# Altium project pca10184.PrjPcb (part 5 of 5)

## Sheet pca10184_level_shifters.SchDoc: =ProductName + ' - Level Shifters'
size A3; Organization: Nordic Semiconductor; DocumentNumber: 4; Revision: 0.7.0; SheetNumber: 4; SheetTotal: 9; Author: GETR; CompanyName: Nordic Semiconductor; DrawnBy: GETR; DocumentSize: A4; ProjectName: pca10184.PrjPcb
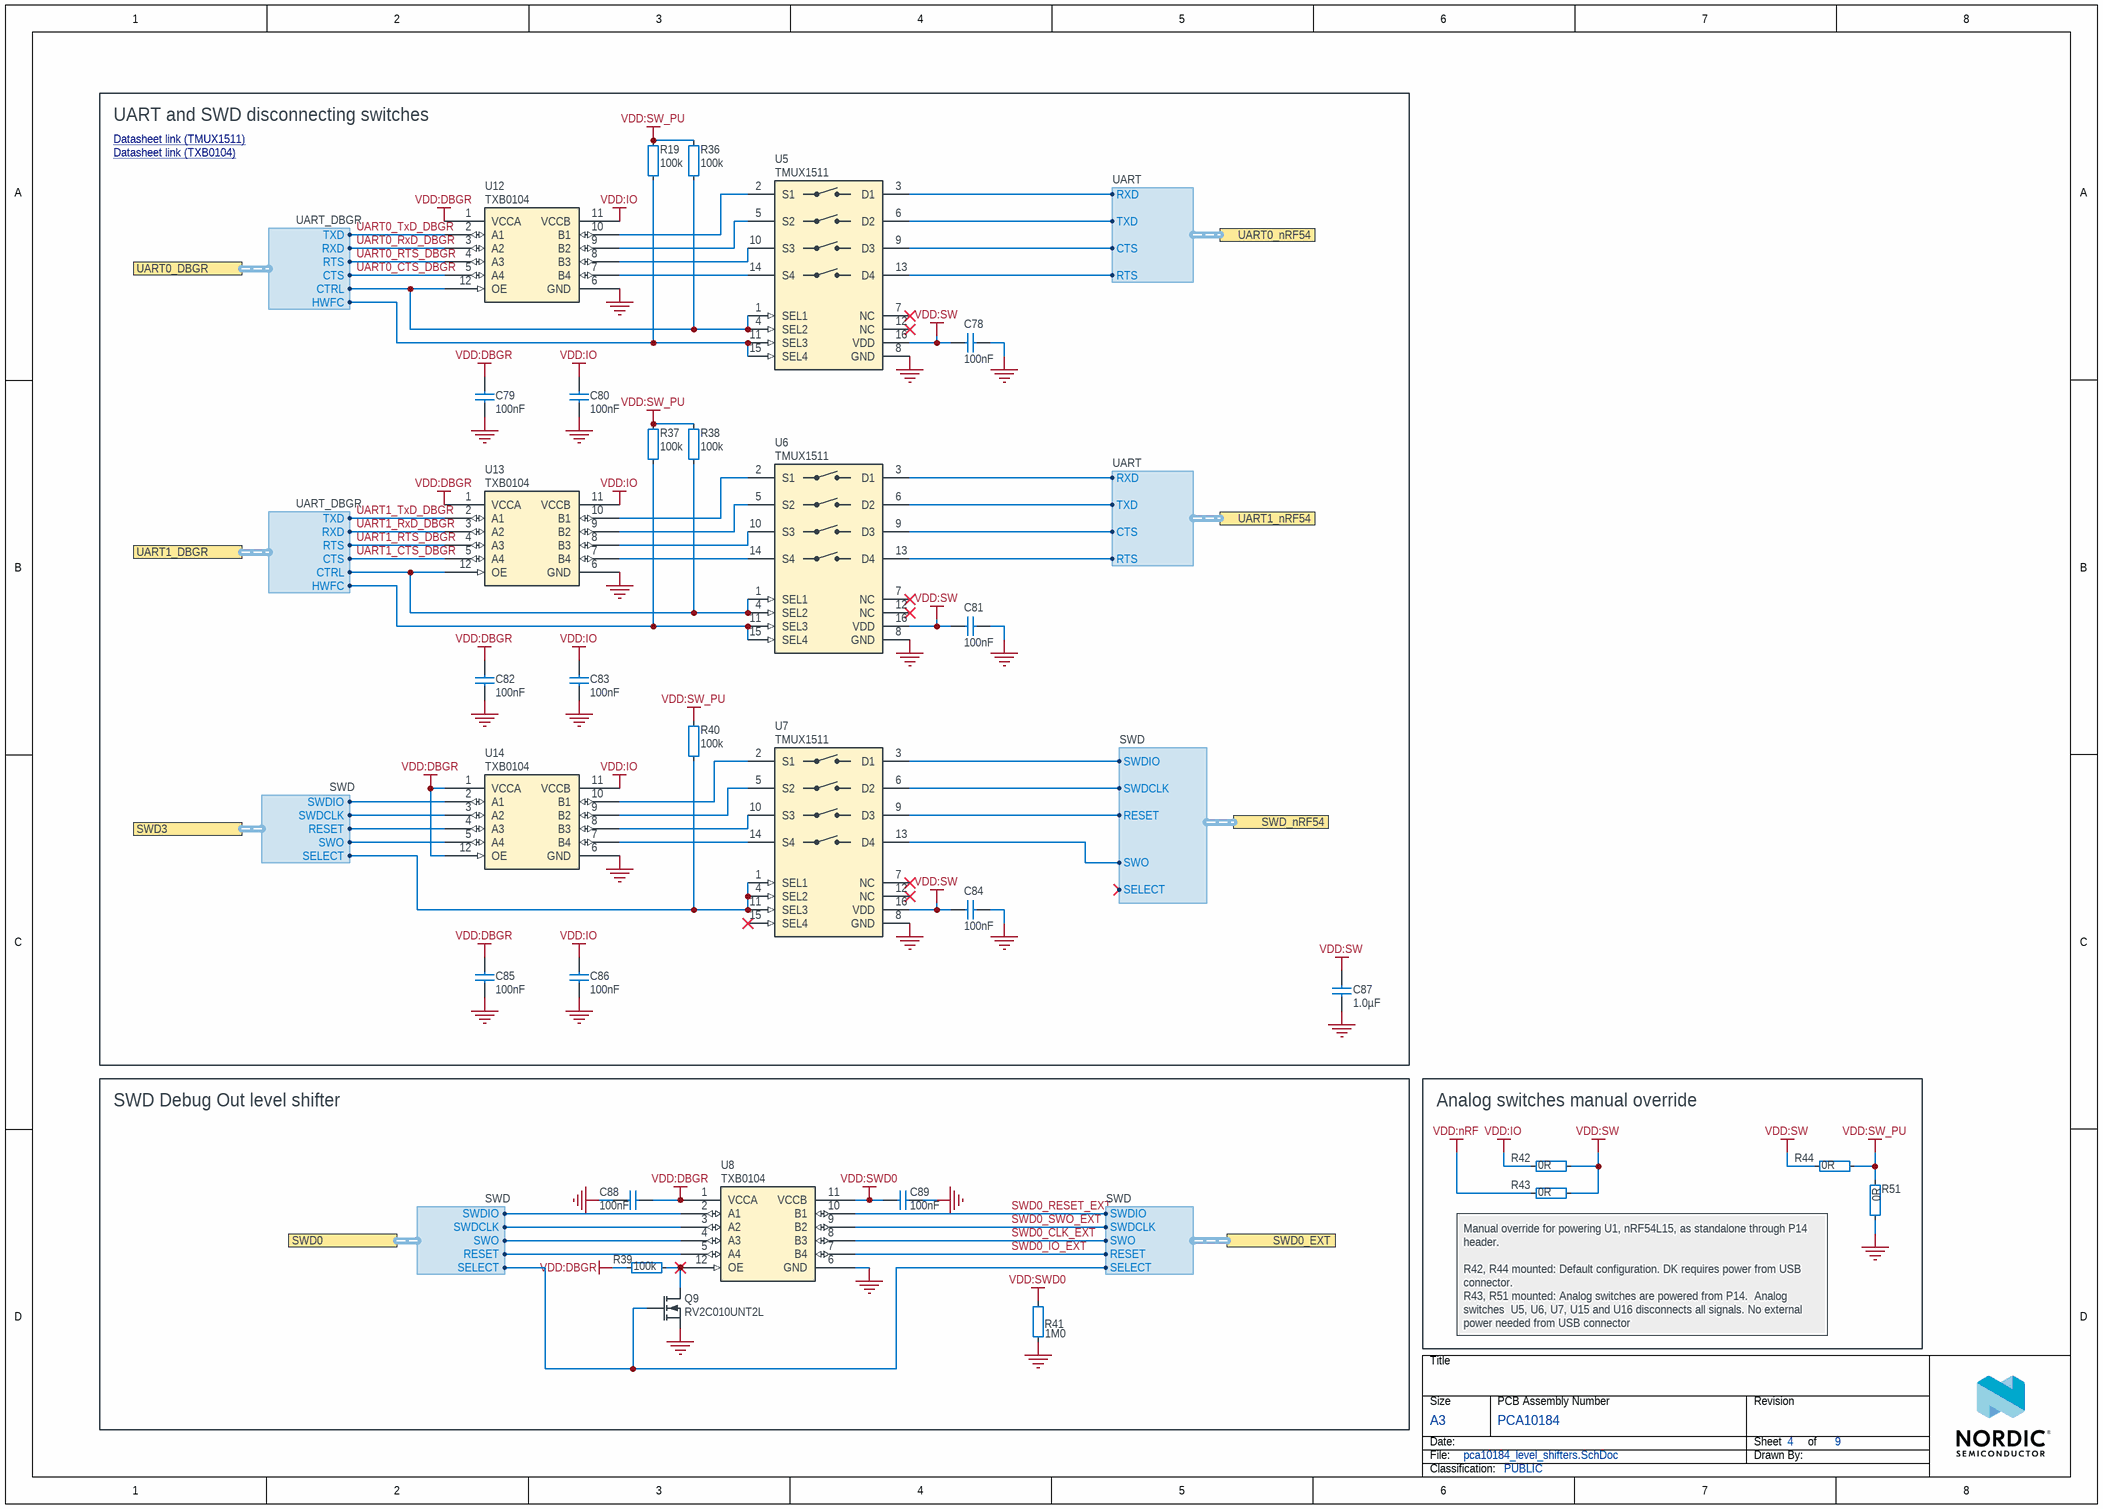
[diagram p7: pca10184_level_shifters.SchDoc]

### Parts
C78  100nF  [CAPC0603X03L_C]
C79  100nF  [CAPC0603X03L_C]
C80  100nF  [CAPC0603X03L_C]
C81  100nF  [CAPC0603X03L_C]
C82  100nF  [CAPC0603X03L_C]
C83  100nF  [CAPC0603X03L_C]
C84  100nF  [CAPC0603X03L_C]
C85  100nF  [CAPC0603X03L_C]
C86  100nF  [CAPC0603X03L_C]
C87  1.0µF  [CAPC1005X04L]
C88  100nF  [CAPC0603X03L_C]
C89  100nF  [CAPC0603X03L_C]
Q9  RV2C010UNT2L  [DFN65P100X40-3L]
R19  100k  [RESC0603X03L_C]
R36  100k  [RESC0603X03L_C]
R37  100k  [RESC0603X03L_C]
R38  100k  [RESC0603X03L_C]
R39  100k  [RESC0603X03L_C]
R40  100k  [RESC0603X03L_C]
R41  1M0  [RESC0603X03L_C]
R42  0R  [RESC1005X04L]
R43  0R  [RESC1005X04L]
R44  0R  [RESC1005X04L]
R51  0R  [RESC1005X04L]
U5  TMUX1511  [XQFN40P180X260X50-16N]
U6  TMUX1511  [XQFN40P180X260X50-16N]
U7  TMUX1511  [XQFN40P180X260X50-16N]
U8  TXB0104  [QFN12P40_170X200X55L50X20]
U12  TXB0104  [QFN12P40_170X200X55L50X20]
U13  TXB0104  [QFN12P40_170X200X55L50X20]
U14  TXB0104  [QFN12P40_170X200X55L50X20]

### Blocks framed on the sheet
UART and SWD disconnecting switches: C78-C87 R19 R36-R38 R40 U5-U7 U12-U14
SWD Debug Out level shifter: C88 C89 Q9 R39 R41 U8
Analog switches manual override: R42-R44 R51

### Ports
SWD0 (harness SWD), SWD0_EXT (harness SWD), SWD3 (harness SWD), SWD_nRF54 (harness SWD), UART0_DBGR (harness UART_DBGR), UART0_nRF54 (harness UART), UART1_DBGR (harness UART_DBGR), UART1_nRF54 (harness UART)

### Harnesses
SWD: SWDIO, SWDCLK, SWO, RESET, SELECT
UART_DBGR: RTS, CTS, RXD, TXD, HWFC, CTRL
UART: RTS, CTS, RXD, TXD

### Nets
GND: C78.2 C79.2 C80.2 C81.2 C82.2 C83.2 C84.2 C85.2 C86.2 C87.1 C88.1 C89.2 Q9.2(S) R41.1 R51.2 U5.8(GND) U6.8(GND) U7.8(GND) U8.6(GND) U12.6(GND) U13.6(GND) U14.6(GND)
VDD:DBGR: C79.1 C82.1 C85.1 C88.2 R39.2 U8.1(VCCA) U12.1(VCCA) U13.1(VCCA) U14.1(VCCA) U14.12(OE)
VDD:IO: C80.1 C83.1 C86.1 R42.1 U12.11(VCCB) U13.11(VCCB) U14.11(VCCB)
VDD:nRF: R43.1
VDD:SW: C78.1 C81.1 C84.1 C87.2 R42.2 R43.2 R44.2 U5.16(VDD) U6.16(VDD) U7.16(VDD)
VDD:SW_PU: R19.1 R36.1 R37.1 R38.1 R40.1 R44.1 R51.1
VDD:SWD0: C89.1 R41.2 U8.11(VCCB)
nRF54_RESET: U7.9(D3) ; port SWD_nRF54.RESET
P0.06: U5.6(D2) ; port UART0_nRF54.TXD
P0.07: U5.3(D1) ; port UART0_nRF54.RXD
P0.08: U5.13(D4) ; port UART0_nRF54.RTS
P0.09: U5.9(D3) ; port UART0_nRF54.CTS
P1.16: U6.6(D2) ; port UART1_nRF54.TXD
P1.17: U6.3(D1) ; port UART1_nRF54.RXD
P1.18: U6.13(D4) ; port UART1_nRF54.RTS
P1.19: U6.9(D3) ; port UART1_nRF54.CTS
P2.07: U7.13(D4) ; port SWD_nRF54.SWO
SWD0_CLK_EXT: U8.8(B3) ; port SWD0_EXT.SWO
SWD0_IO_EXT: U8.7(B4) ; port SWD0_EXT.RESET
SWD0_RESET_EXT: U8.10(B1) ; port SWD0_EXT.SWDIO
SWD0_SEL: Q9.1(G) ; port SWD0.SELECT, port SWD0_EXT.SELECT
SWD0_SWO_EXT: U8.9(B2) ; port SWD0_EXT.SWDCLK
SWD3_CTRL: R40.2 U7.1(SEL1) U7.4(SEL2) U7.11(SEL3) ; port SWD3.SELECT
SWDCLK: U7.6(D2) ; port SWD_nRF54.SWDCLK
SWDIO: U7.3(D1) ; port SWD_nRF54.SWDIO
UART0_CTRL: R36.2 U5.1(SEL1) U5.4(SEL2) U12.12(OE) ; port UART0_DBGR.CTRL
UART0_CTS_DBGR: U12.5(A4) ; port UART0_DBGR.CTS
UART0_HWFC: R19.2 U5.11(SEL3) U5.15(SEL4) ; port UART0_DBGR.HWFC
UART0_RTS_DBGR: U12.4(A3) ; port UART0_DBGR.RTS
UART0_RxD_DBGR: U12.3(A2) ; port UART0_DBGR.RXD
UART0_TxD_DBGR: U12.2(A1) ; port UART0_DBGR.TXD
UART1_CTRL: R38.2 U6.1(SEL1) U6.4(SEL2) U13.12(OE) ; port UART1_DBGR.CTRL
UART1_CTS_DBGR: U13.5(A4) ; port UART1_DBGR.CTS
UART1_HWFC: R37.2 U6.11(SEL3) U6.15(SEL4) ; port UART1_DBGR.HWFC
UART1_RTS_DBGR: U13.4(A3) ; port UART1_DBGR.RTS
UART1_RxD_DBGR: U13.3(A2) ; port UART1_DBGR.RXD
UART1_TxD_DBGR: U13.2(A1) ; port UART1_DBGR.TXD
NetQ9_3: Q9.3(D) R39.1 U8.12(OE)
NetR6_2: U8.2(A1) ; port SWD0.SWDIO
NetR12_2: U8.3(A2) ; port SWD0.SWDCLK
NetR13_2: U8.4(A3) ; port SWD0.SWO
NetR47_2: U8.5(A4) ; port SWD0.RESET
NetR48_2: U14.2(A1) ; port SWD3.SWDIO
NetR49_2: U14.3(A2) ; port SWD3.SWDCLK
NetR50_2: U14.4(A3) ; port SWD3.RESET
NetR57_2: U14.5(A4) ; port SWD3.SWO
NetU5_2: U5.2(S1) U12.10(B1)
NetU5_5: U5.5(S2) U12.9(B2)
NetU5_10: U5.10(S3) U12.8(B3)
NetU5_14: U5.14(S4) U12.7(B4)
NetU6_2: U6.2(S1) U13.10(B1)
NetU6_5: U6.5(S2) U13.9(B2)
NetU6_10: U6.10(S3) U13.8(B3)
NetU6_14: U6.14(S4) U13.7(B4)
NetU7_2: U7.2(S1) U14.10(B1)
NetU7_5: U7.5(S2) U14.9(B2)
NetU7_10: U7.10(S3) U14.8(B3)
NetU7_14: U7.14(S4) U14.7(B4)

Not connected (* = marked no-connect by the designer): U5 7(NC)* 12(NC)*; U6 7(NC)* 12(NC)*; U7 7(NC)* 12(NC)* 15(SEL4)*

### Notes on the sheet
- Datasheet link (TMUX1511) <https://www.ti.com/lit/ds/symlink/tmux1511.pdf?ts=1730882090102&ref_url=https%253A%252F%252Fwww.mouser.dk%252F>
- Datasheet link (TXB0104) <https://www.ti.com/lit/ds/symlink/txb0104.pdf?src-supplier=IHS+Markit>
- (near R43) Manual override for powering U1, nRF54L15, as standalone through P14 header.
  R42, R44 mounted: Default configuration. DK requires power from USB connector.
  R43, R51 mounted: Analog switches are powered from P14.  Analog switches  U5, U6, U7, U15 and U16 disconnects all signals. No external power needed from USB connector
- Title
- Size
- Date:
- File:
- A3
- PCB Assembly Number
- Sheet
- Drawn By:
- Revision
- of
- Classification:

### Library data of the parts
C78-C86 C88 C89 = C0201-100n: Capacitor, X5R, ±10%; Manufacturer: N.A.; Part number IPS: 00000001248, 00000002505; Part number Norautron: 262071862; Part number NEMS: 100200078; Pad Count: 2; Note: 16V; Component Status: Active; Part Number: C0201-100n; Value: 100nF; Footprint Doc: 0201; Component Class: Capacitors; Author: rsk; PartId: 100200078; Manufacturer Part Number: N.A.; ComponentLink1URL: N.A.; ComponentLink1Description: Datasheet; ComponentLink2URL: N.A.; ComponentLink2Description: Supplier link; HelpURL: N.A.; LatestRevisionDate: 2017-11-09; Published: 2014-11-13; Supplier 1: N.A.; Supplier Part Number 1: N.A.; Supplier 2: N.A.; Supplier Part Number 2: N.A.; Artikkelnr Noca: N.A.
C87 = C0402-1µ0-6.3V-X5R-10%: Capacitor, X5R, ±10%, 6.3V; Manufacturer: N.A.; Part number Norautron: 26207137; Part number NEMS: 100200498; Pad Count: 2; Component Status: Active; Part Number: C0402-1µ0-6.3V-X5R-10%; Manufacturer Part Number: N.A.; LatestRevisionDate: 2022-01-27; Published: 2022-01-27; Value: 1.0µF; Note: 6.3V; Artikkelnr Noca: N.A.; Footprint Doc: 0402; ComponentLink1URL: N.A.; ComponentLink1Description: Datasheet; ComponentLink2URL: N.A.; ComponentLink2Description: Supplier link; HelpURL: N.A.; Supplier 1: N.A.; Supplier Part Number 1: N.A.; Supplier 2: N.A.; Supplier Part Number 2: N.A.; Part number IPS: N.A.; Component Class: Capacitors; PartId: 100200498; Author: rubr
Q9 = RV2C010UNT2L: as Q4-Q7 on sheet pca10184_misc; Part Number: RV2C010UNT2L; Manufacturer Part Number: RV2C010UNT2L; ComponentLink1URL: N.A.; ComponentLink1Description: Datasheet; ComponentLink2URL: N.A.; ComponentLink2Description: Supplier link; HelpURL: http://rohmfs.rohm.com/en/products/databook/datasheet/discrete/transistor/mosfet/rv2c010unt2l-e.pdf; Footprint Doc: DFN-3; LatestRevisionDate: 2024-09-18; Published: 2016-08-09; Value: RV2C010UNT2L; Supplier 1: Digi-Key; Supplier Part Number 1: RV2C010UNT2LCT-ND; Supplier 2: Mouser; Supplier Part Number 2: 755-RV2C010UNT2L; PartId: 101300132; Component Class: Semiconductors; Author: rsk
R19 R36-R40 = R0201-100k: Resistor, ±1%, 0.05W; Manufacturer: N.A.; Part number IPS: 00000001419; Part number Norautron: 26108487; Part number NEMS: 100100080; Note: Chip Res 1%; Pad Count: 2; Component Status: Active; Part Number: R0201-100k; Manufacturer Part Number: N.A.; ComponentLink1URL: N.A.; ComponentLink1Description: Datasheet; ComponentLink2URL: N.A.; ComponentLink2Description: Supplier link; HelpURL: N.A.; Footprint Doc: 0201; LatestRevisionDate: 2014-11-13; Published: 2014-11-13; Value: 100k; Artikkelnr Noca: N.A.; Supplier 1: N.A.; Supplier Part Number 1: N.A.; Supplier 2: N.A.; Supplier Part Number 2: N.A.; Component Class: Resistors; PartId: 100100080; Author: rsk
R41 = R0201-1M0: Resistor, ±1%, 0.05W; Manufacturer: N.A.; Part number IPS: 00000001418; Part number Norautron: 26107108; Part number NEMS: 100100093; Component Status: Active; Pad Count: 2; Note: Chip Res 1%; Part Number: R0201-1M0; PartId: 100100093; Component Class: Resistors; Author: rsk; Manufacturer Part Number: N.A.; ComponentLink1URL: N.A.; ComponentLink1Description: Datasheet; ComponentLink2URL: N.A.; ComponentLink2Description: Supplier link; HelpURL: N.A.; LatestRevisionDate: 2014-11-13; Published: 2014-11-13; Footprint Doc: 0201; Value: 1M0; Supplier 1: N.A.; Supplier Part Number 1: N.A.; Supplier 2: N.A.; Supplier Part Number 2: N.A.; Artikkelnr Noca: N.A.
R42-R44 R51 = R0402-0R: Resistor, ±5%, 0.063W; Manufacturer: N.A.; Part number IPS: 00000007128; Part number NEMS: 100100109; Component Status: Active; Pad Count: 2; Note: Chip Res 5%; Artikkelnr Noca: 27049000; Part Number: R0402-0R; PartId: 100100109; Component Class: Resistors; Author: rsk; Manufacturer Part Number: N.A.; ComponentLink1URL: N.A.; ComponentLink1Description: Datasheet; ComponentLink2URL: N.A.; ComponentLink2Description: Supplier link; HelpURL: N.A.; LatestRevisionDate: 2009-11-23; Published: 2009-05-08; Footprint Doc: 0402; Value: 0R; Supplier 1: Farnell; Supplier Part Number 1: 146-9661; Supplier 2: N.A.; Supplier Part Number 2: N.A.; Part number Norautron: N.A.
U5-U7 = TMUX1511: Low-Capacitance, 1:1 (SPST) 4-Channel, analog switch; Manufacturer: Texas Instruments; Manufacturer Part Number: TMUX1511RSVR; Part number NEMS: 101900847; Component Status: Active; Pad Count: 16; Note: N.A.; Part Number: TMUX1511; Component Class: Misc_ICs; Author: stl1; ComponentLink1URL: https://www.ti.com/lit/ds/symlink/tmux1511.pdf?ts=1730882090102&ref_url=https%253A%252F%252Fwww.mouser.dk%252F; ComponentLink1Description: Datasheet; ComponentLink2URL: N.A.; ComponentLink2Description: Supplier link; HelpURL: https://www.ti.com/lit/ds/symlink/tmux1511.pdf?ts=1730882090102&ref_url=https%253A%252F%252Fwww.mouser.dk%252F; LatestRevisionDate: 2024-12-05; Published: 2024-12-05; Footprint Doc: UFQFN-16; Value: TMUX1511; Supplier 1: Digi-Key; Supplier Part Number 1: 296-53443-2-ND; Supplier 2: Mouser; Supplier Part Number 2: 595-TMUX1511RSVR; Artikkelnr Noca: N.A.; Part number IPS: N.A.; Part number Norautron: N.A.; PartId: 101900847
U8 U12-U14 = TXB0104RUTR: 4-Bit Bidirectional Level-Shifter/Voltage Translator with Automatic Direction Sensing; Manufacturer: Texas Instruments; Part number NEMS: 101900856; Component Status: Active; Pad Count: 12; Note: Translator, Bidirectional; Artikkelnr Noca: N.A.; Part Number: TXB0104RUTR; Component Class: Misc_ICs; Author: stl1; Manufacturer Part Number: TXB0104RUTR; ComponentLink1URL: N.A.; ComponentLink1Description: Datasheet; ComponentLink2URL: N.A.; ComponentLink2Description: Supplier link; HelpURL: https://www.ti.com/lit/ds/symlink/txb0104.pdf?ts=1738584719537&ref_url=https%253A%252F%252Fwww.mouser.com%252F; LatestRevisionDate: 2025-02-04; Published: 2025-02-04; Footprint Doc: 12-UFQFN; Value: TXB0104; Supplier 1: Digi-Key; Supplier Part Number 1: 296-25888-2-ND; Supplier 2: Mouser; Supplier Part Number 2: 595-TXB0104RUTR; Part number IPS: N.A.; Part number Norautron: N.A.; PartId: 101900856

## Sheet pca10184_switches.SchDoc: =BoardTitle+' - QSPI Switching'
size A3; Organization: Nordic Semiconductor; DocumentNumber: 7; Revision: 0.7.0; SheetNumber: 7; SheetTotal: 9; Author: GETR; CompanyName: Nordic Semiconductor; DrawnBy: GETR; DocumentSize: A4; ProjectName: pca10184.PrjPcb
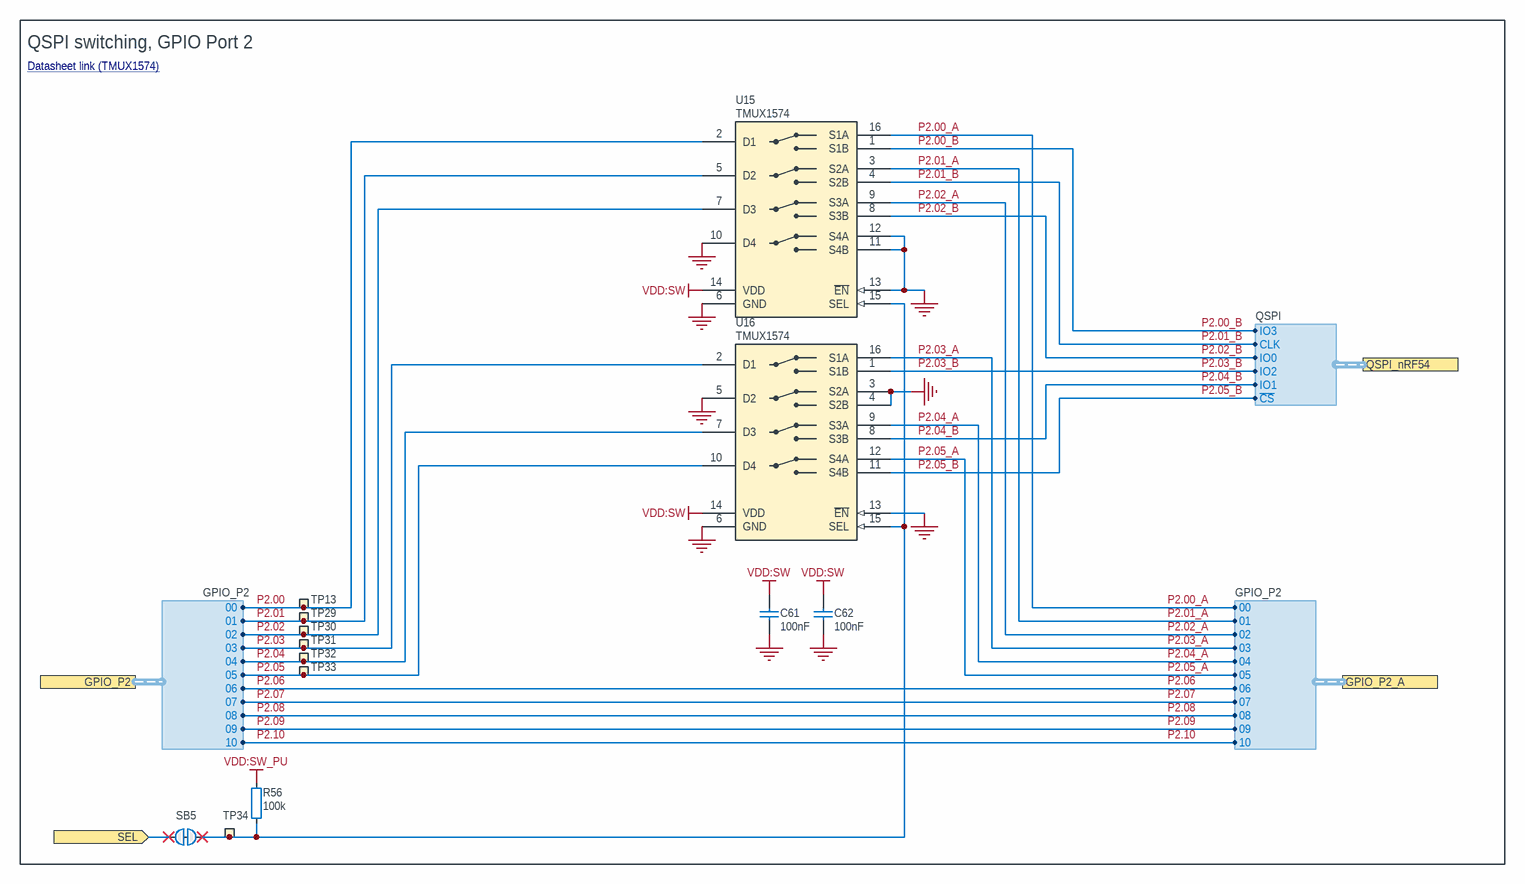
[diagram p8: pca10184_switches.SchDoc]

### Parts
C61  100nF  [CAPC0603X03L_C]
C62  100nF  [CAPC0603X03L_C]
R56  100k  [RESC0603X03L_C]
SB5  Solderbridge  [Solderbridge_Shorted]  (value not drawn)  (net tie, no BOM)
TP13  Ø0.7mm,SMD  [TP_SMD_D0.7mm]  (value not drawn)  (no BOM)
TP29  Ø0.7mm,SMD  [TP_SMD_D0.7mm]  (value not drawn)  (no BOM)
TP30  Ø0.7mm,SMD  [TP_SMD_D0.7mm]  (value not drawn)  (no BOM)
TP31  Ø0.7mm,SMD  [TP_SMD_D0.7mm]  (value not drawn)  (no BOM)
TP32  Ø0.7mm,SMD  [TP_SMD_D0.7mm]  (value not drawn)  (no BOM)
TP33  Ø0.7mm,SMD  [TP_SMD_D0.7mm]  (value not drawn)  (no BOM)
TP34  Ø0.7mm,SMD  [TP_SMD_D0.7mm]  (value not drawn)  (no BOM)
U15  TMUX1574  [XQFN40P180X260X50-16N]
U16  TMUX1574  [XQFN40P180X260X50-16N]

### Ports
GPIO_P2 (harness GPIO_P2), GPIO_P2_A (harness GPIO_P2), QSPI_nRF54 (harness QSPI), SEL (in)

### Harnesses
GPIO_P2: 00, 01, 02, 03, 04, 05, 06, 07, 08, 09, 10
QSPI: ~{CS}, IO0, CLK, IO1, IO2, IO3

### Nets
GND: C61.2 C62.2 U15.6(GND) U15.10(D4) U15.11(S4B) U15.12(S4A) U15.13(~{EN}) U16.3(S2A) U16.4(S2B) U16.5(D2) U16.6(GND) U16.13(~{EN})
VDD:SW: C61.1 C62.1 U15.14(VDD) U16.14(VDD)
VDD:SW_PU: R56.2
P2.00: TP13.1 U15.2(D1) ; port GPIO_P2.00
P2.00_A: U15.16(S1A) ; port GPIO_P2_A.00
P2.00_B: U15.1(S1B) ; port QSPI_nRF54.IO3
P2.01: TP29.1 U15.5(D2) ; port GPIO_P2.01
P2.01_A: U15.3(S2A) ; port GPIO_P2_A.01
P2.01_B: U15.4(S2B) ; port QSPI_nRF54.CLK
P2.02: TP30.1 U15.7(D3) ; port GPIO_P2.02
P2.02_A: U15.9(S3A) ; port GPIO_P2_A.02
P2.02_B: U15.8(S3B) ; port QSPI_nRF54.IO0
P2.03: TP31.1 U16.2(D1) ; port GPIO_P2.03
P2.03_A: U16.16(S1A) ; port GPIO_P2_A.03
P2.03_B: U16.1(S1B) ; port QSPI_nRF54.IO2
P2.04: TP32.1 U16.7(D3) ; port GPIO_P2.04
P2.04_A: U16.9(S3A) ; port GPIO_P2_A.04
P2.04_B: U16.8(S3B) ; port QSPI_nRF54.IO1
P2.05: TP33.1 U16.10(D4) ; port GPIO_P2.05
P2.05_A: U16.12(S4A) ; port GPIO_P2_A.05
P2.05_B: U16.11(S4B) ; port QSPI_nRF54.~{CS}
P2.06: port GPIO_P2.06, port GPIO_P2_A.06
P2.07: port GPIO_P2.07, port GPIO_P2_A.07
P2.08: port GPIO_P2.08, port GPIO_P2_A.08
P2.09: port GPIO_P2.09, port GPIO_P2_A.09
P2.10: port GPIO_P2.10, port GPIO_P2_A.10
QSPI_CTRL: SB5.1 ; port SEL
NetR56_1: R56.1 SB5.2 TP34.1 U15.15(SEL) U16.15(SEL)

### Notes on the sheet
- QSPI switching, GPIO Port 2
- Datasheet link (TMUX1574) <https://www.ti.com/lit/ds/symlink/tmux1574.pdf?ts=1730869182960>
- Title
- Size
- Date:
- File:
- A3
- PCB Assembly Number
- Sheet
- Drawn By:
- Revision
- of
- Classification:

### Library data of the parts
C61 C62 = C0201-100n: as C78-C86 on sheet pca10184_level_shifters; Part Number: C0201-100n; LatestRevisionDate: 2017-11-09; Published: 2014-11-13; Value: 100nF; Footprint Doc: 0201; Component Class: Capacitors; PartId: 100200078; Author: rsk; Manufacturer Part Number: N.A.; ComponentLink1URL: N.A.; ComponentLink1Description: Datasheet; ComponentLink2URL: N.A.; ComponentLink2Description: Supplier link; HelpURL: N.A.; Supplier 1: N.A.; Supplier Part Number 1: N.A.; Supplier 2: N.A.; Supplier Part Number 2: N.A.; Artikkelnr Noca: N.A.
R56 = R0201-100k: as R19 on sheet pca10184_level_shifters; Part Number: R0201-100k; Manufacturer Part Number: N.A.; ComponentLink1URL: N.A.; ComponentLink1Description: Datasheet; ComponentLink2URL: N.A.; ComponentLink2Description: Supplier link; HelpURL: N.A.; Footprint Doc: 0201; LatestRevisionDate: 2014-11-13; Published: 2014-11-13; Value: 100k; Artikkelnr Noca: N.A.; Supplier 1: N.A.; Supplier Part Number 1: N.A.; Supplier 2: N.A.; Supplier Part Number 2: N.A.; Component Class: Resistors; PartId: 100100080; Author: rsk
SB5 = Solderbridge Shorted: Shorted Solderbridge; Manufacturer: N.A.; Part number NEMS: 100500459; Pad Count: 2; Component Status: Active; System: Connector; Part Number: Solderbridge Shorted; Manufacturer Part Number: N.A.; LatestRevisionDate: 2012-08-07; Published: 2012-08-07; Value: Solderbridge; Note: N.A.; Artikkelnr Noca: N.A.; Footprint Doc: Solderbridge_Shorted; Part number IPS: N.A.; ComponentLink1URL: N.A.; ComponentLink1Description: Datasheet; ComponentLink2URL: N.A.; ComponentLink2Description: Supplier link; HelpURL: N.A.; Supplier 1: N.A.; Supplier Part Number 1: N.A.; Supplier 2: N.A.; Supplier Part Number 2: N.A.; Component Class: Connectors; PartId: 100500459; Author: rsk; Part number Norautron: N.A.
TP13 TP29-TP34 = TP_SMD_Ø0.7MM: 0.7mm circular SMD testpad; Manufacturer: Nordic Semiconductor; Manufacturer Part Number: N.A.; Part number NEMS: 100500474; Component Status: Active; Pad Count: 1; Part Number: TP_SMD_Ø0.7MM; PartId: 100500474; Component Class: Connectors; Author: rsk; ComponentLink1URL: N.A.; ComponentLink1Description: Datasheet; ComponentLink2URL: N.A.; ComponentLink2Description: Supplier link; HelpURL: N.A.; LatestRevisionDate: 2021-03-05; Published: 2017-12-14; Footprint Doc: TP_SMD_Ø0.7mm; Value: Ø0.7mm,SMD; Note: N.A.; Supplier 1: N.A.; Supplier Part Number 1: N.A.; Supplier 2: N.A.; Supplier Part Number 2: N.A.; Artikkelnr Noca: N.A.; Part number IPS: N.A.; Part number Norautron: N.A.
U15 U16 = TMUX1574: Low-Capacitance, 2:1 (SPDT) 4-Channel, analog switch; Manufacturer: Texas Instruments; Manufacturer Part Number: TMUX1574RSVR; Part number NEMS: 101900850; Component Status: Active; Pad Count: 16; Note: N.A.; Part Number: TMUX1574; Component Class: Misc_ICs; Author: stl1; ComponentLink1URL: https://www.ti.com/lit/ds/symlink/tmux1574.pdf?ts=1730869182960; ComponentLink1Description: Datasheet; ComponentLink2URL: N.A.; ComponentLink2Description: Supplier link; HelpURL: https://www.ti.com/lit/ds/symlink/tmux1574.pdf?ts=1730869182960; LatestRevisionDate: 2024-11-20; Published: 2024-11-20; Footprint Doc: UFQFN-16; Value: TMUX1574; Supplier 1: Digi-Key; Supplier Part Number 1: 296-53445-2-ND; Supplier 2: Mouser; Supplier Part Number 2: 595-TMUX1574RSVR; Artikkelnr Noca: N.A.; Part number IPS: N.A.; Part number Norautron: N.A.; PartId: 101900850

## Nets that join several sheets
5V0:CONN: pca10184_power_supply (SB31.1), pca10184_connectors (6 pins)
GND: pca10184_debugger_mcu (33 pins), pca10184_power_supply (42 pins), pca10184_nrf54lm20 (29 pins), pca10184_connectors (54 pins), pca10184_misc (18 pins), pca10184_level_shifters (22 pins), pca10184_switches (12 pins)
P5V0: pca10184_debugger_mcu (FB5.2), pca10184_power_supply (8 pins)
P5V0:LED: pca10184_power_supply (C52.2 TP1.1 U3.31), pca10184_misc (R25.2 R26.2 R27.2 R28.2)
VBUS: pca10184_debugger_mcu (J2.5), pca10184_power_supply (10 pins)
VBUS:DBGR: pca10184_debugger_mcu (R5.2), pca10184_power_supply (Q2.1 R20.1 R21.1), pca10184_connectors (C69.2 FB4.2)
VBUS:nRF: pca10184_power_supply (SB6.2), pca10184_nrf54lm20 (R1.2), pca10184_connectors (C63.2 FB3.2)
VDD:DBGR: pca10184_debugger_mcu (29 pins), pca10184_power_supply (C54.1 U3.12), pca10184_misc (R35.2), pca10184_level_shifters (10 pins)
VDD:IO: pca10184_power_supply (6 pins), pca10184_connectors (14 pins), pca10184_misc (SB23.1), pca10184_level_shifters (7 pins)
VDD:nRF: pca10184_power_supply (P14.2 R15.1 R55.1 SB19.2), pca10184_nrf54lm20 (9 pins), pca10184_misc (SB24.1), pca10184_level_shifters (R43.1)
VDD:SW: pca10184_level_shifters (10 pins), pca10184_switches (C61.1 C62.1 U15.14 U16.14)
VDD:SW_PU: pca10184_level_shifters (7 pins), pca10184_switches (R56.2)
VDD:SWD0: pca10184_connectors (P13.1), pca10184_level_shifters (C89.1 R41.2 U8.11)
DBGR_BUTTON: pca10184_top_level (SB26.2), pca10184_debugger_mcu (U2.AL27)
LED_PWR_CTRL: pca10184_debugger_mcu (U2.A17), pca10184_power_supply (U3.8)
NetJ4_A5: pca10184_power_supply (U3.23), pca10184_connectors (J4.A5)
NetJ4_B5: pca10184_power_supply (U3.24), pca10184_connectors (J4.B5)
NetR6_2: pca10184_debugger_mcu (R6.2), pca10184_level_shifters (U8.2)
NetR12_2: pca10184_debugger_mcu (R12.2), pca10184_level_shifters (U8.3)
NetR13_2: pca10184_debugger_mcu (R13.2), pca10184_level_shifters (U8.4)
NetR47_2: pca10184_debugger_mcu (R47.2), pca10184_level_shifters (U8.5)
NetR48_2: pca10184_debugger_mcu (R48.2), pca10184_level_shifters (U14.2)
NetR49_2: pca10184_debugger_mcu (R49.2), pca10184_level_shifters (U14.3)
NetR50_2: pca10184_debugger_mcu (R50.2), pca10184_level_shifters (U14.4)
NetR57_2: pca10184_debugger_mcu (R57.2), pca10184_level_shifters (U14.5)
NetSB22_1: pca10184_top_level (SB25.2 SB26.1), pca10184_misc (SB22.1 SW6.2)
NFC1_N: pca10184_connectors (J5.2 TP26.1), pca10184_misc (C56.1 R33.2)
NFC2_P: pca10184_connectors (J5.4 TP28.1), pca10184_misc (C57.2 R34.2)
NFC_N: pca10184_nrf54lm20 (R3.2 U1.J6), pca10184_misc (R33.1)
NFC_P: pca10184_nrf54lm20 (R4.2 U1.J7), pca10184_misc (R34.1)
nRF54_RESET: pca10184_top_level (SB25.1), pca10184_nrf54lm20 (U1.F2), pca10184_connectors (P11.10 P12.10), pca10184_level_shifters (U7.9)
P0.00: pca10184_nrf54lm20 (U1.K3), pca10184_connectors (P1.3)
P0.01: pca10184_nrf54lm20 (U1.K2), pca10184_connectors (P1.4)
P0.02: pca10184_nrf54lm20 (U1.J3), pca10184_connectors (P1.5)
P0.03: pca10184_nrf54lm20 (U1.J2), pca10184_connectors (P1.6 P17.11)
P0.04: pca10184_nrf54lm20 (U1.J1), pca10184_connectors (P1.7 P17.12)
P0.05: pca10184_nrf54lm20 (U1.H3), pca10184_connectors (P1.8), pca10184_misc (SW4.2)
P0.06: pca10184_nrf54lm20 (U1.H2), pca10184_connectors (P1.9), pca10184_level_shifters (U5.6)
P0.07: pca10184_nrf54lm20 (U1.G3), pca10184_connectors (P1.10), pca10184_level_shifters (U5.3)
P0.08: pca10184_nrf54lm20 (U1.F3), pca10184_connectors (P1.11), pca10184_level_shifters (U5.13)
P0.09: pca10184_nrf54lm20 (U1.E3), pca10184_connectors (P1.12), pca10184_level_shifters (U5.9)
P1.00: pca10184_nrf54lm20 (U1.K8), pca10184_connectors (P2.3 P17.5)
P1.01: pca10184_nrf54lm20 (R3.1), pca10184_connectors (P2.4)
P1.02: pca10184_nrf54lm20 (R4.1), pca10184_connectors (P2.5)
P1.03: pca10184_nrf54lm20 (U1.H9), pca10184_connectors (P2.6 P17.6)
P1.04: pca10184_nrf54lm20 (U1.J9), pca10184_connectors (P2.7 P17.7)
P1.05: pca10184_nrf54lm20 (U1.H8), pca10184_connectors (P2.8 P17.17)
P1.06: pca10184_nrf54lm20 (U1.J8), pca10184_connectors (P2.9 P17.16)
P1.07: pca10184_nrf54lm20 (U1.G8), pca10184_connectors (P2.10 P17.15)
P1.08: pca10184_nrf54lm20 (U1.F8), pca10184_connectors (P2.11), pca10184_misc (SW3.2)
P1.09: pca10184_nrf54lm20 (U1.E8), pca10184_connectors (P2.12), pca10184_misc (SW2.2)
P1.10: pca10184_nrf54lm20 (U1.D5), pca10184_connectors (P2.13)
P1.11: pca10184_nrf54lm20 (U1.C5), pca10184_connectors (P2.14)
P1.12: pca10184_nrf54lm20 (U1.C4), pca10184_connectors (P2.15)
P1.13: pca10184_nrf54lm20 (U1.C3), pca10184_connectors (P2.16 P17.8)
P1.14: pca10184_nrf54lm20 (U1.C2), pca10184_connectors (P2.17)
P1.15: pca10184_nrf54lm20 (U1.B2), pca10184_connectors (P2.18)
P1.16: pca10184_nrf54lm20 (U1.B3), pca10184_connectors (P3.3), pca10184_level_shifters (U6.6)
P1.17: pca10184_nrf54lm20 (U1.B4), pca10184_connectors (P3.4), pca10184_level_shifters (U6.3)
P1.18: pca10184_nrf54lm20 (U1.B5), pca10184_connectors (P3.5), pca10184_level_shifters (U6.13)
P1.19: pca10184_nrf54lm20 (U1.B6), pca10184_connectors (P3.6), pca10184_level_shifters (U6.9)
P1.20: pca10184_nrf54lm20 (SB3.2), pca10184_connectors (P3.7)
P1.21: pca10184_nrf54lm20 (SB4.2), pca10184_connectors (P3.8)
P1.22: pca10184_nrf54lm20 (U1.D6), pca10184_connectors (P3.9), pca10184_misc (Q4.1 R32.1)
P1.23: pca10184_nrf54lm20 (U1.B7), pca10184_connectors (P3.10)
P1.24: pca10184_nrf54lm20 (U1.D7), pca10184_connectors (P3.11)
P1.25: pca10184_nrf54lm20 (U1.E7), pca10184_connectors (P3.12), pca10184_misc (Q5.1 R29.1)
P1.26: pca10184_nrf54lm20 (U1.B8), pca10184_connectors (P3.13), pca10184_misc (SW1.2)
P1.27: pca10184_nrf54lm20 (U1.C8), pca10184_connectors (P3.14), pca10184_misc (Q6.1 R30.1)
P1.28: pca10184_nrf54lm20 (U1.D8), pca10184_connectors (P3.15), pca10184_misc (Q7.1 R31.1)
P1.29: pca10184_nrf54lm20 (U1.H10), pca10184_connectors (P3.16)
P1.30: pca10184_nrf54lm20 (U1.J10), pca10184_connectors (P3.17)
P1.31: pca10184_nrf54lm20 (U1.K9), pca10184_connectors (P3.18)
P2.00: pca10184_nrf54lm20 (U1.B10), pca10184_switches (TP13.1 U15.2)
P2.00_A: pca10184_connectors (P4.3 P17.21), pca10184_switches (U15.16)
P2.00_B: pca10184_misc (U4.7), pca10184_switches (U15.1)
P2.01: pca10184_nrf54lm20 (U1.C10), pca10184_switches (TP29.1 U15.5)
P2.01_A: pca10184_connectors (P4.4 P17.22), pca10184_switches (U15.3)
P2.01_B: pca10184_misc (U4.6), pca10184_switches (U15.4)
P2.02: pca10184_nrf54lm20 (U1.D10), pca10184_switches (TP30.1 U15.7)
P2.02_A: pca10184_connectors (P4.5 P17.23), pca10184_switches (U15.9)
P2.02_B: pca10184_misc (U4.5), pca10184_switches (U15.8)
P2.03: pca10184_nrf54lm20 (U1.E10), pca10184_switches (TP31.1 U16.2)
P2.03_A: pca10184_connectors (P4.6 P17.24), pca10184_switches (U16.16)
P2.03_B: pca10184_misc (U4.3), pca10184_switches (U16.1)
P2.04: pca10184_nrf54lm20 (U1.F10), pca10184_switches (TP32.1 U16.7)
P2.04_A: pca10184_connectors (P4.7 P17.25), pca10184_switches (U16.9)
P2.04_B: pca10184_misc (U4.2), pca10184_switches (U16.8)
P2.05: pca10184_nrf54lm20 (U1.G9), pca10184_switches (TP33.1 U16.10)
P2.05_A: pca10184_connectors (P4.8 P17.26), pca10184_switches (U16.12)
P2.05_B: pca10184_misc (U4.1), pca10184_switches (U16.11)
P2.06: pca10184_nrf54lm20 (U1.B9), pca10184_connectors (P4.9 P12.12)
P2.07: pca10184_nrf54lm20 (U1.C9), pca10184_connectors (P4.10 P11.6 P12.6 P12.14), pca10184_level_shifters (U7.13)
P2.08: pca10184_nrf54lm20 (U1.D9), pca10184_connectors (P4.11 P12.16)
P2.09: pca10184_nrf54lm20 (U1.E9), pca10184_connectors (P4.12 P12.18)
P2.10: pca10184_nrf54lm20 (U1.F9), pca10184_connectors (P4.13 P12.20)
P3.00: pca10184_nrf54lm20 (U1.H7), pca10184_connectors (P5.3 P17.9)
P3.01: pca10184_nrf54lm20 (U1.H6), pca10184_connectors (P5.4 P17.10)
P3.02: pca10184_nrf54lm20 (U1.H5), pca10184_connectors (P5.5 P17.13)
P3.03: pca10184_nrf54lm20 (U1.H4), pca10184_connectors (P5.6 P17.14)
P3.04: pca10184_nrf54lm20 (U1.J4), pca10184_connectors (P5.7 P17.4)
P3.05: pca10184_nrf54lm20 (U1.G7), pca10184_connectors (P5.8 P17.3)
P3.06: pca10184_nrf54lm20 (U1.G6), pca10184_connectors (P5.9 P17.18)
P3.07: pca10184_nrf54lm20 (U1.G5), pca10184_connectors (P5.10)
P3.08: pca10184_nrf54lm20 (U1.G4), pca10184_connectors (P5.11)
P3.09: pca10184_nrf54lm20 (U1.F7), pca10184_connectors (P5.12)
P3.10: pca10184_nrf54lm20 (U1.F4), pca10184_connectors (P5.13)
P3.11: pca10184_nrf54lm20 (U1.E4), pca10184_connectors (P5.14)
P3.12: pca10184_nrf54lm20 (U1.D4), pca10184_connectors (P5.15)
QSPI_CTRL: pca10184_debugger_mcu (U2.B14), pca10184_switches (SB5.1)
SWD0_CLK_EXT: pca10184_connectors (P13.6), pca10184_level_shifters (U8.8)
SWD0_IO_EXT: pca10184_connectors (P13.10), pca10184_level_shifters (U8.7)
SWD0_RESET_EXT: pca10184_connectors (P13.2), pca10184_level_shifters (U8.10)
SWD0_SEL: pca10184_debugger_mcu (U2.B24), pca10184_connectors (P13.3), pca10184_level_shifters (Q9.1)
SWD0_SWO_EXT: pca10184_connectors (P13.4), pca10184_level_shifters (U8.9)
SWD3_CTRL: pca10184_debugger_mcu (U2.AB2), pca10184_level_shifters (R40.2 U7.1 U7.4 U7.11)
SWDCLK: pca10184_nrf54lm20 (U1.G1), pca10184_connectors (P11.4 P12.4), pca10184_level_shifters (U7.6)
SWDIO: pca10184_nrf54lm20 (U1.G2), pca10184_connectors (P11.2 P12.2), pca10184_level_shifters (U7.3)
TWI0_SCL: pca10184_debugger_mcu (U2.AF2), pca10184_power_supply (U3.14)
TWI0_SDA: pca10184_debugger_mcu (U2.AE1), pca10184_power_supply (U3.13)
UART0_CTRL: pca10184_debugger_mcu (U2.R31), pca10184_level_shifters (R36.2 U5.1 U5.4 U12.12)
UART0_CTS_DBGR: pca10184_debugger_mcu (R9.1 U2.AL9), pca10184_level_shifters (U12.5)
UART0_HWFC: pca10184_debugger_mcu (U2.AK16), pca10184_level_shifters (R19.2 U5.11 U5.15)
UART0_RTS_DBGR: pca10184_debugger_mcu (U2.AL5), pca10184_level_shifters (U12.4)
UART0_RxD_DBGR: pca10184_debugger_mcu (U2.AL19), pca10184_level_shifters (U12.3)
UART0_TxD_DBGR: pca10184_debugger_mcu (U2.U31), pca10184_level_shifters (U12.2)
UART1_CTRL: pca10184_debugger_mcu (U2.AK18), pca10184_level_shifters (R38.2 U6.1 U6.4 U13.12)
UART1_CTS_DBGR: pca10184_debugger_mcu (R10.1 U2.AL15), pca10184_level_shifters (U13.5)
UART1_HWFC: pca10184_debugger_mcu (U2.AK20), pca10184_level_shifters (R37.2 U6.11 U6.15)
UART1_RTS_DBGR: pca10184_debugger_mcu (U2.AL13), pca10184_level_shifters (U13.4)
UART1_RxD_DBGR: pca10184_debugger_mcu (U2.AL21), pca10184_level_shifters (U13.3)
UART1_TxD_DBGR: pca10184_debugger_mcu (U2.AL23), pca10184_level_shifters (U13.2)
USB_DBGR_N: pca10184_debugger_mcu (U2.B4), pca10184_connectors (L9.4)
USB_DBGR_P: pca10184_debugger_mcu (U2.B2), pca10184_connectors (L9.3)
USB_nRF54_D+: pca10184_nrf54lm20 (U1.K5), pca10184_connectors (L8.3)
USB_nRF54_D-: pca10184_nrf54lm20 (U1.K4), pca10184_connectors (L8.4)

## Assembly variants
pca10184 - Main: not fitted C13 C33 C50 P11 P12 R3 R4 R15 R43 R51